# Altium schematic sheet System_Diagram.SchDoc
size A4; SheetNumber: 1; SheetTotal: 5
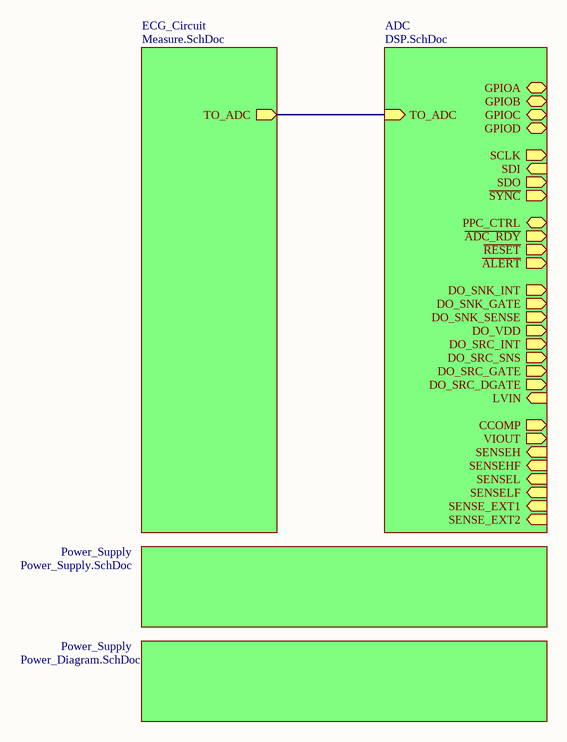
[diagram p0: System_Diagram.SchDoc]

## Sub-sheets
ADC = DSP.SchDoc: TO_ADC (in), GPIOA (bidir), GPIOB (bidir), GPIOC (bidir), GPIOD (bidir), SCLK (out), SDI (in), SDO (out), ~{SYNC} (out), PPC_CTRL (bidir), ~{ADC_RDY} (out), ~{RESET} (out), ~{ALERT} (out), DO_SNK_INT (out), DO_SNK_GATE (out), DO_SNK_SENSE (out), DO_VDD (out), DO_SRC_INT (out), DO_SRC_SNS (out), DO_SRC_GATE (out), DO_SRC_DGATE (out), LVIN (in), CCOMP (out), VIOUT (out), SENSEH (in), SENSEHF (in), SENSEL (in), SENSELF (in), SENSE_EXT1 (in), SENSE_EXT2 (in)
ECG_Circuit = Measure.SchDoc: TO_ADC (out)
Power_Supply = Power_Supply.SchDoc: no entries
Power_Supply = Power_Diagram.SchDoc: no entries

## Nets
(unnamed): sheet ECG_Circuit/TO_ADC, sheet ADC/TO_ADC